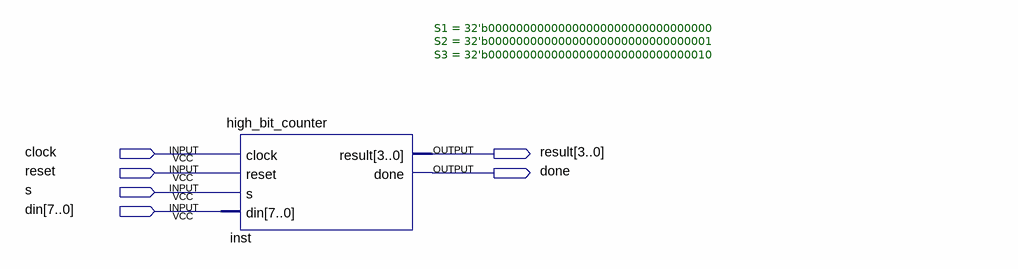
[diagram p0: schematic sheet]
// Quartus schematic Lab11Part1.bdf as structural Verilog: 1 symbols, 6 pins
module Lab11Part1 (
  input  clock,
  input  reset,
  input  s,
  input  [7:0] din,
  output [3:0] result,
  output done
);

  high_bit_counter #(.S1(32'b00000000000000000000000000000000), .S2(32'b00000000000000000000000000000001), .S3(32'b00000000000000000000000000000010)) inst (
    .clock(clock), .reset(reset), .s(s), .din(din), .result(result), .done(done));
endmodule
